# EasyEDA schematic WFD_Schematic.json
TITLE: Wet_Floor_Sensor; REV: 1.0; Date: 2021-09-13; Sheet: 1/1; Drawn By: Dhinesh_R; Company: FlamencoTech
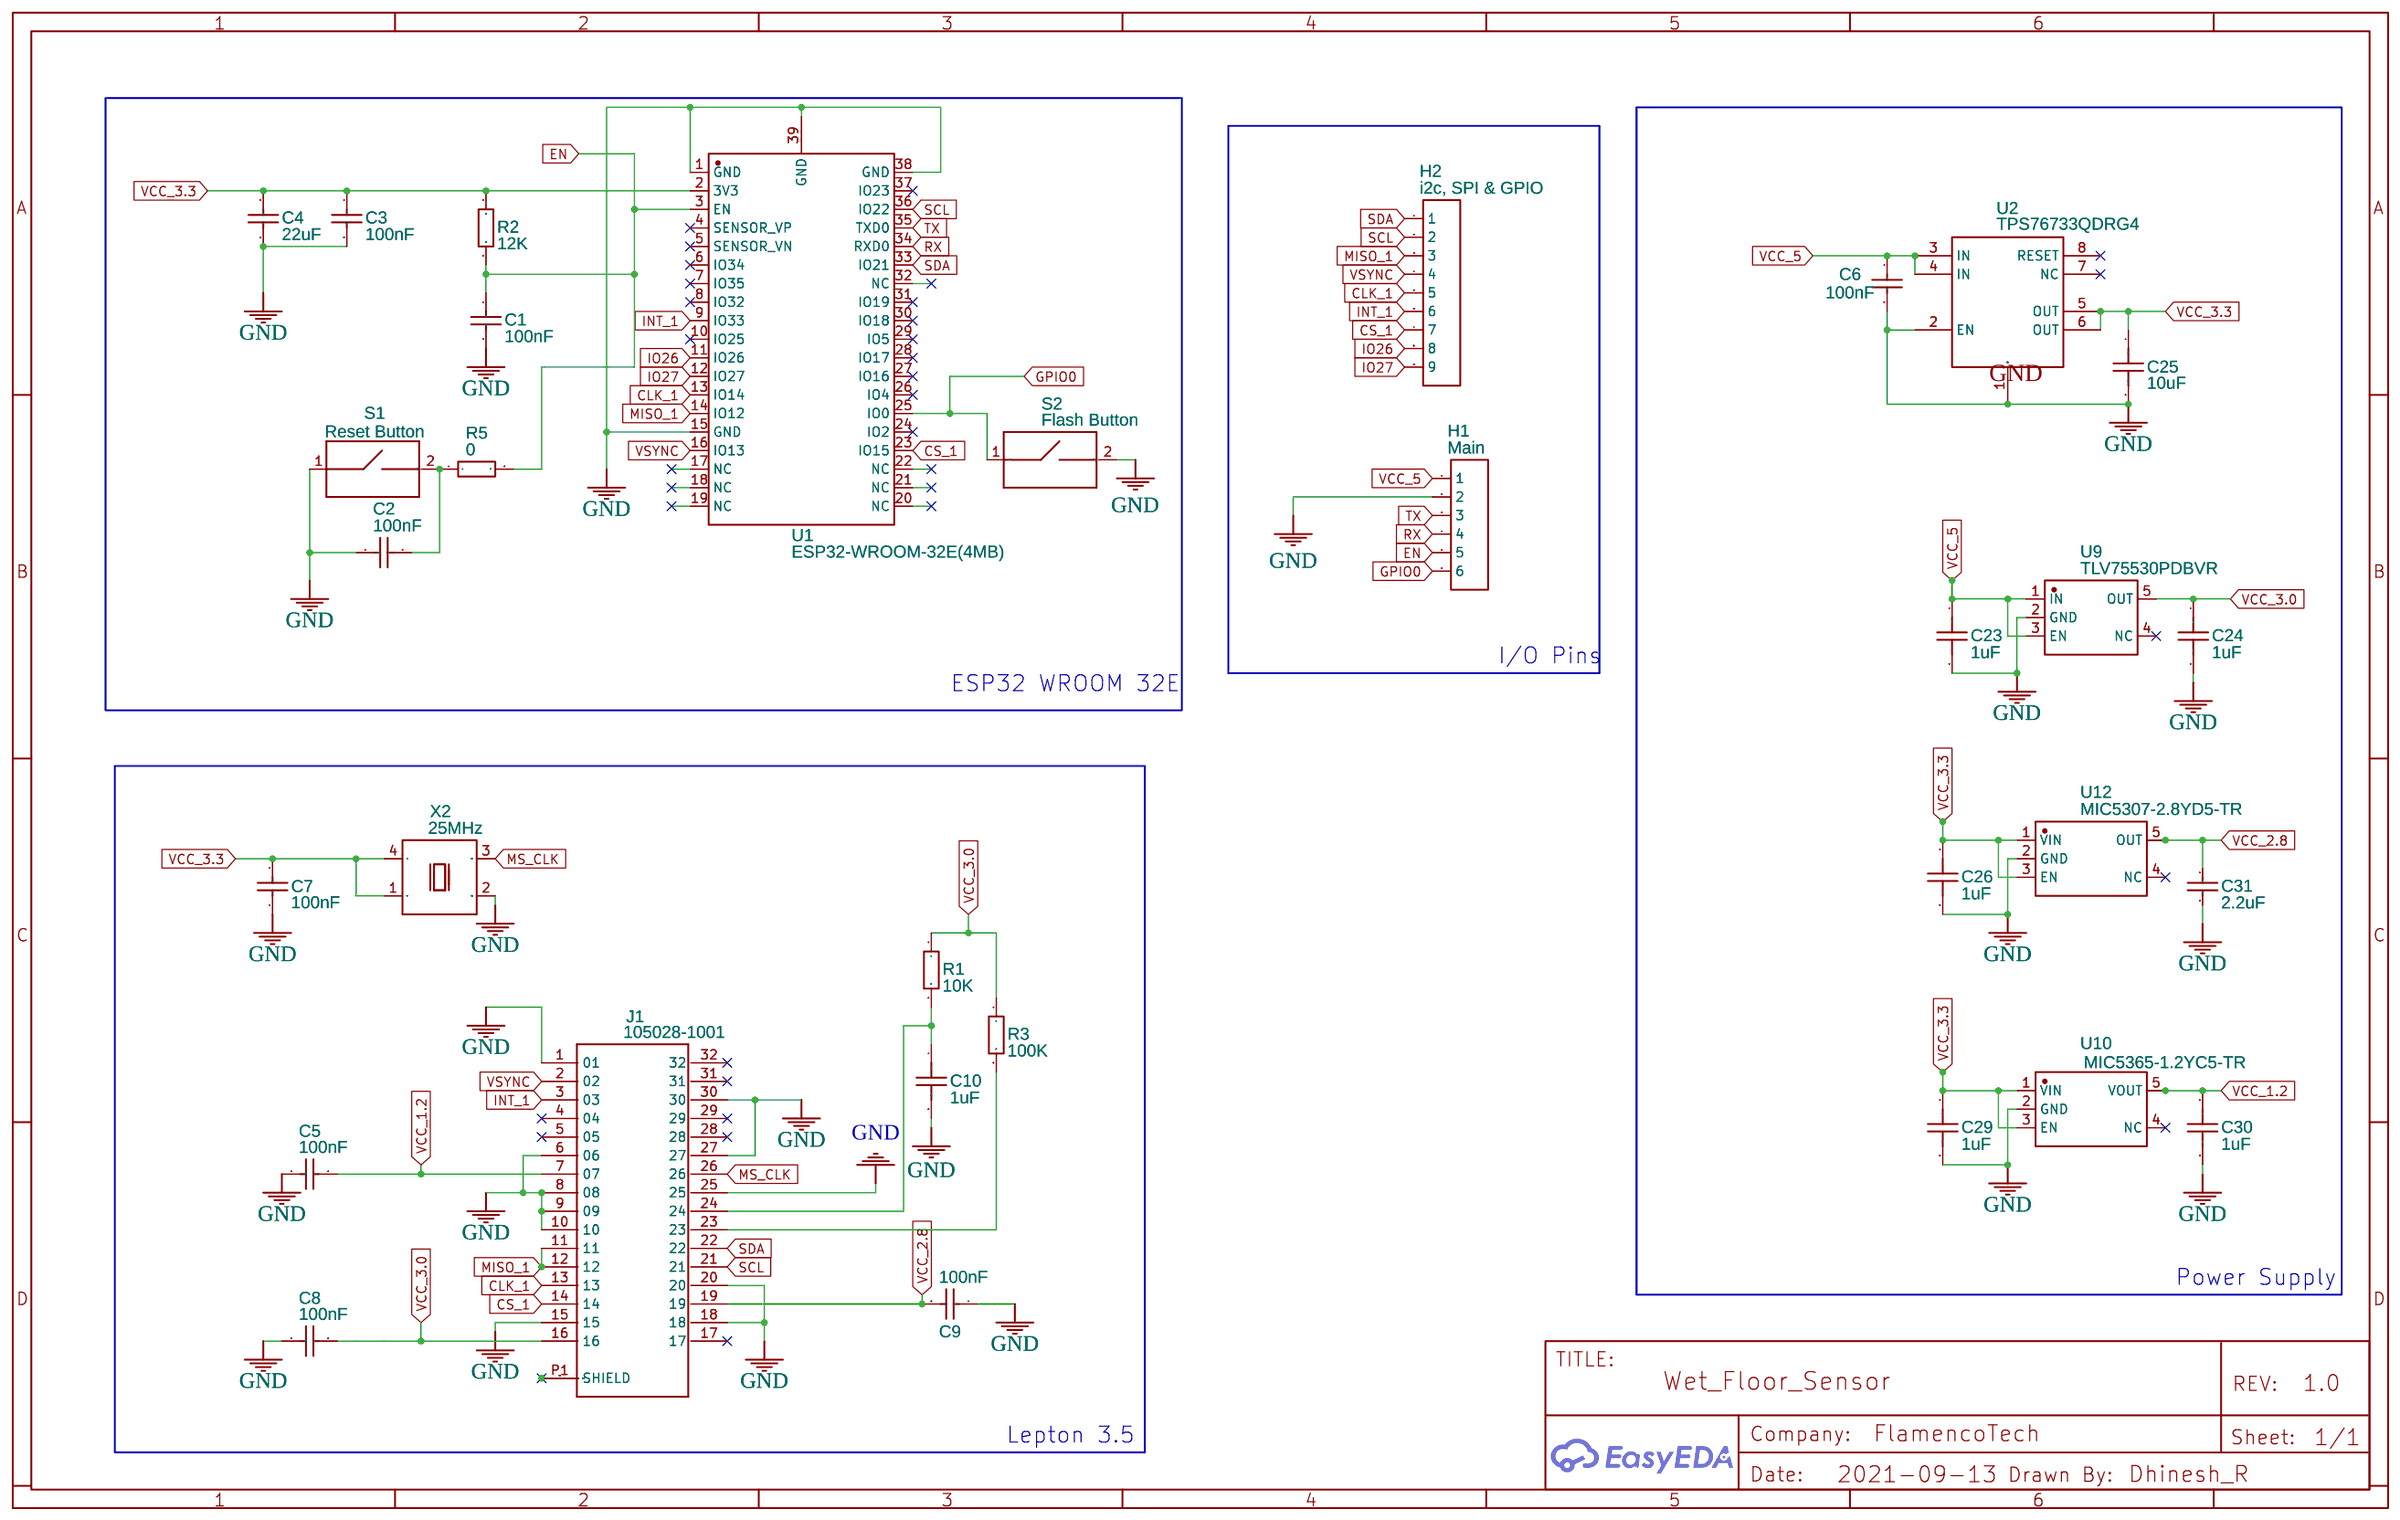
[diagram p0: schematic sheet]

## Parts
C1  100nF  [C0402_NEW]
C2  100nF  [C0402_NEW]
C3  100nF  [C0402_NEW]
C4  22uF  [C0603]
C5  100nF  [C0402_NEW]
C6  100nF  [C0402_NEW]
C7  100nF  [C0402_NEW]
C8  100nF  [C0402_NEW]
C9  100nF  [C0402_NEW]
C10  1uF  [C0603]
C23  1uF  [C0603]
C24  1uF  [C0603]
C25  10uF  [C0402]
C26  1uF  [C0603]
C29  1uF  [C0603]
C30  1uF  [C0603]
C31  2.2uF  [C0402]
H1  Main  [HDR-TH_6P-P2.54-V-M-1]
H2  i2c, SPI & GPIO  [HDR-TH_9P-P2.54-V-F-1]
J1  105028-1001  [MOLEX_105028-1001]
R1  10K  [R0402]
R2  12K  [R0402]
R3  100K  [R0402]
R5  0  [R0402]
S1  Reset Button  [SW_1437566-4]
S2  Flash Button  [SW_1437566-4]
U1  ESP32-WROOM-32E(4MB)  [WIFI-SMD_ESP32-WROOM-32E]
U2  TPS76733QDRG4  [SOIC8]
U9  TLV75530PDBVR  [SOT-23-5_L3.0-W1.7-P0.95-LS2.8-BR]
U10  MIC5365-1.2YC5-TR  [SC-70-5_L2.1-W1.3-P0.65-LS2.1-BL]
U12  MIC5307-2.8YD5-TR  [TSOT-23-5_L2.9-W1.6-P0.95-LS2.8-BL]
X2  25MHz  [OSC-SMD_4P-L3.2-W2.5-BL]

## Library data of the parts
C1-C3 C5-C9 = CL05B104KO5NNNC: Supplier: LCSC; Manufacturer: SAMSUNG; Supplier Part: C1525; JLCPCB Part Class: Basic Part
C4 = GRM188B30J226MEA0D: Supplier: LCSC; Manufacturer: MuRata; Supplier Part: C15500; Paste Type: Extended Part; JLCPCB Part Class: Extended Part
C10 C23 C24 C26 C29 C30 = TMK107B7105KA-T: Supplier: LCSC; Manufacturer: TAIYO YUDEN; Supplier Part: C92827
C25 = GRM155C80J106ME11D: Supplier: LCSC; Supplier Part: C237279; Manufacturer: Murata Electronics; Contributor: LCSC; JLCPCB Part Class: Extended Part
C31 = 0402X225K6R3NT: Supplier: LCSC; Supplier Part: C193620; Manufacturer: FH(Guangdong Fenghua Advanced Tech); Contributor: LCSC; JLCPCB Part Class: Extended Part
H1 = Header-Male-2.54_1x6: Supplier: LCSC; Manufacturer: BOOMELE; Supplier Part: C37208; JLCPCB Part Class: Extended Part
H2 = Header-Female-2.54_1x9: Supplier: LCSC; Manufacturer: BOOMELE; Manufacturer Part: 2.54mm 1*9 Straight Female header; Supplier Part: C39576; JLCPCB Part Class: Extended Part
J1 = 105028-1001
R1-R3 = 0402WGF1202TCE: Supplier: LCSC; Manufacturer: UniOhm; Supplier Part: C25752; JLCPCB Part Class: Basic Part
R5 = RMC040201%N: Supplier: LCSC; Supplier Part: C325377; Manufacturer: Tyohm; Contributor: LCSC
S1 S2 = 1437566-4
U1 = ESP32-WROOM-32E(4MB): Supplier: LCSC; Supplier Part: C701341; Manufacturer: Espressif Systems; Contributor: LCSC; JLCPCB Part Class: Extended Part
U2 = TPS76733QDRG4: Single Output Fast Transient Response LDO, 1 A, Fixed 3.3 V Output, 2.7 to 10 V Input, with Low IQ, 8-pin SOIC (D), -40 to 125 degC, Green (RoHS  no SbBr)
U9 = TLV75530PDBVR: Supplier: LCSC; Supplier Part: C507268; Manufacturer: Texas Instruments; Contributor: LCSC
U10 = MIC5365-1.2YC5-TR: Supplier: LCSC; Supplier Part: C461594; Manufacturer: Microchip Tech; Contributor: LCSC
U12 = MIC5307-2.8YD5-TR: Supplier: LCSC; Manufacturer: MICROCHIP; Contributor: LCSC; Supplier Part: C152179; JLCPCB Part Class: Extended Part
X2 = OXETGLJANF-25MHZ: Supplier: LCSC; Supplier Part: C295525; Manufacturer: TAITIEN Elec; Contributor: LCSC; Paste Type: Extended Part; JLCPCB Part Class: Extended Part

## Nets
GND: C1.2 C2.1 C3.2 C4.2 C5.2 C6.2 C7.1 C8.2 C9.1 C10.2 C23.2 C24.2 C25.2 C26.2 C29.2 C30.2 C31.2 H1.2 J1.1(01) J1.6(06) J1.8(08) J1.9(09) J1.10 J1.15 J1.18 J1.20 J1.25 J1.27 J1.30 S1.1 S2.2 U1.1(GND) U1.15(GND) U1.38(GND) U1.39(GND) U2.1(GND) U2.2(EN) U9.2(GND) U10.2(GND) U12.2(GND) X2.2(GND)
VCC_1.2: C5.1 C30.1 J1.7(07) U10.5(VOUT)
VCC_2.8: C9.2 C31.1 J1.19 U12.5(OUT)
VCC_3.0: C8.1 C24.1 J1.16 R1.1 R3.1 U9.5(OUT)
VCC_3.3: C3.1 C4.1 C7.2 C25.1 C26.1 C29.1 R2.1 U1.2(3V3) U2.5(OUT) U2.6(OUT) U10.1(VIN) U10.3(EN) U12.1(VIN) U12.3(EN) X2.1(tri) X2.4(VCC)
VCC_5: C6.1 C23.1 H1.1 U2.3(IN) U2.4(IN) U9.1(IN) U9.3(EN)
CLK_1: H2.5 J1.13 U1.13(IO14)
CS_1: H2.7 J1.14 U1.23(IO15)
EN: C1.1 H1.5 R2.2 R5.2 U1.3(EN)
GPIO0: H1.6 S2.1 U1.25(IO0)
INT_1: H2.6 J1.3(03) U1.9(IO33)
IO26: H2.8 U1.11(IO26)
IO27: H2.9 U1.12(IO27)
MISO_1: H2.3 J1.11 J1.12 U1.14(IO12)
MS_CLK: J1.26 X2.3(OUT)
RX: H1.4 U1.34(RXD0)
SCL: H2.2 J1.21 U1.36(IO22)
SDA: H2.1 J1.22 U1.33(IO21)
TX: H1.3 U1.35(TXD0)
VSYNC: H2.4 J1.2(02) U1.16(IO13)
Net-(C2-2): C2.2 R5.1 S1.2
Net-(C10-1): C10.1 J1.24 R1.2
Net-(J1-23): J1.23 R3.2
Net-(J1-P1): J1.P1(SHIELD) J1.P2(SHIELD) J1.P3(SHIELD) J1.P4(SHIELD) J1.P5(SHIELD) J1.P6(SHIELD) J1.P7(SHIELD) J1.P8(SHIELD) J1.P9(SHIELD) J1.P10(SHIELD) J1.P11(SHIELD) J1.P12(SHIELD) J1.P13(SHIELD) J1.P14(SHIELD) J1.P15(SHIELD) J1.P16(SHIELD) J1.P17(SHIELD) J1.P18(SHIELD) J1.P19(SHIELD) J1.P20(SHIELD) J1.P21(SHIELD) J1.P22(SHIELD) J1.P23(SHIELD) J1.P24(SHIELD) J1.P25(SHIELD) J1.P26(SHIELD) J1.P27(SHIELD) J1.P28(SHIELD) J1.P29(SHIELD) J1.P30(SHIELD) J1.P31(SHIELD) J1.P32(SHIELD) J1.P33(SHIELD) J1.P34(SHIELD) J1.P35(SHIELD) J1.P36(SHIELD)

Not connected (* = marked no-connect by the designer): J1 4(04)* 5(05)* 17* 28* 29* 31* 32*; U1 4(SENSOR_VP)* 5(SENSOR_VN)* 6(IO34)* 7(IO35)* 8(IO32)* 10(IO25)* 17(NC) 18(NC) 19(NC) 20(NC) 21(NC) 22(NC) 24(IO2)* 26(IO4)* 27(IO16)* 28(IO17)* 29(IO5)* 30(IO18)* 31(IO19)* 32(NC) 37(IO23)*; U2 7(NC)* 8(RESET)*; U9 4(NC)*; U10 4(NC)*; U12 4(NC)*

## Notes on the sheet
- I/O Pins
- ESP32 WROOM 32E
- Power Supply
- Lepton 3.5
